# EAGLE design carrier (EAGLE 5.11)

## Sheet 1 of 3
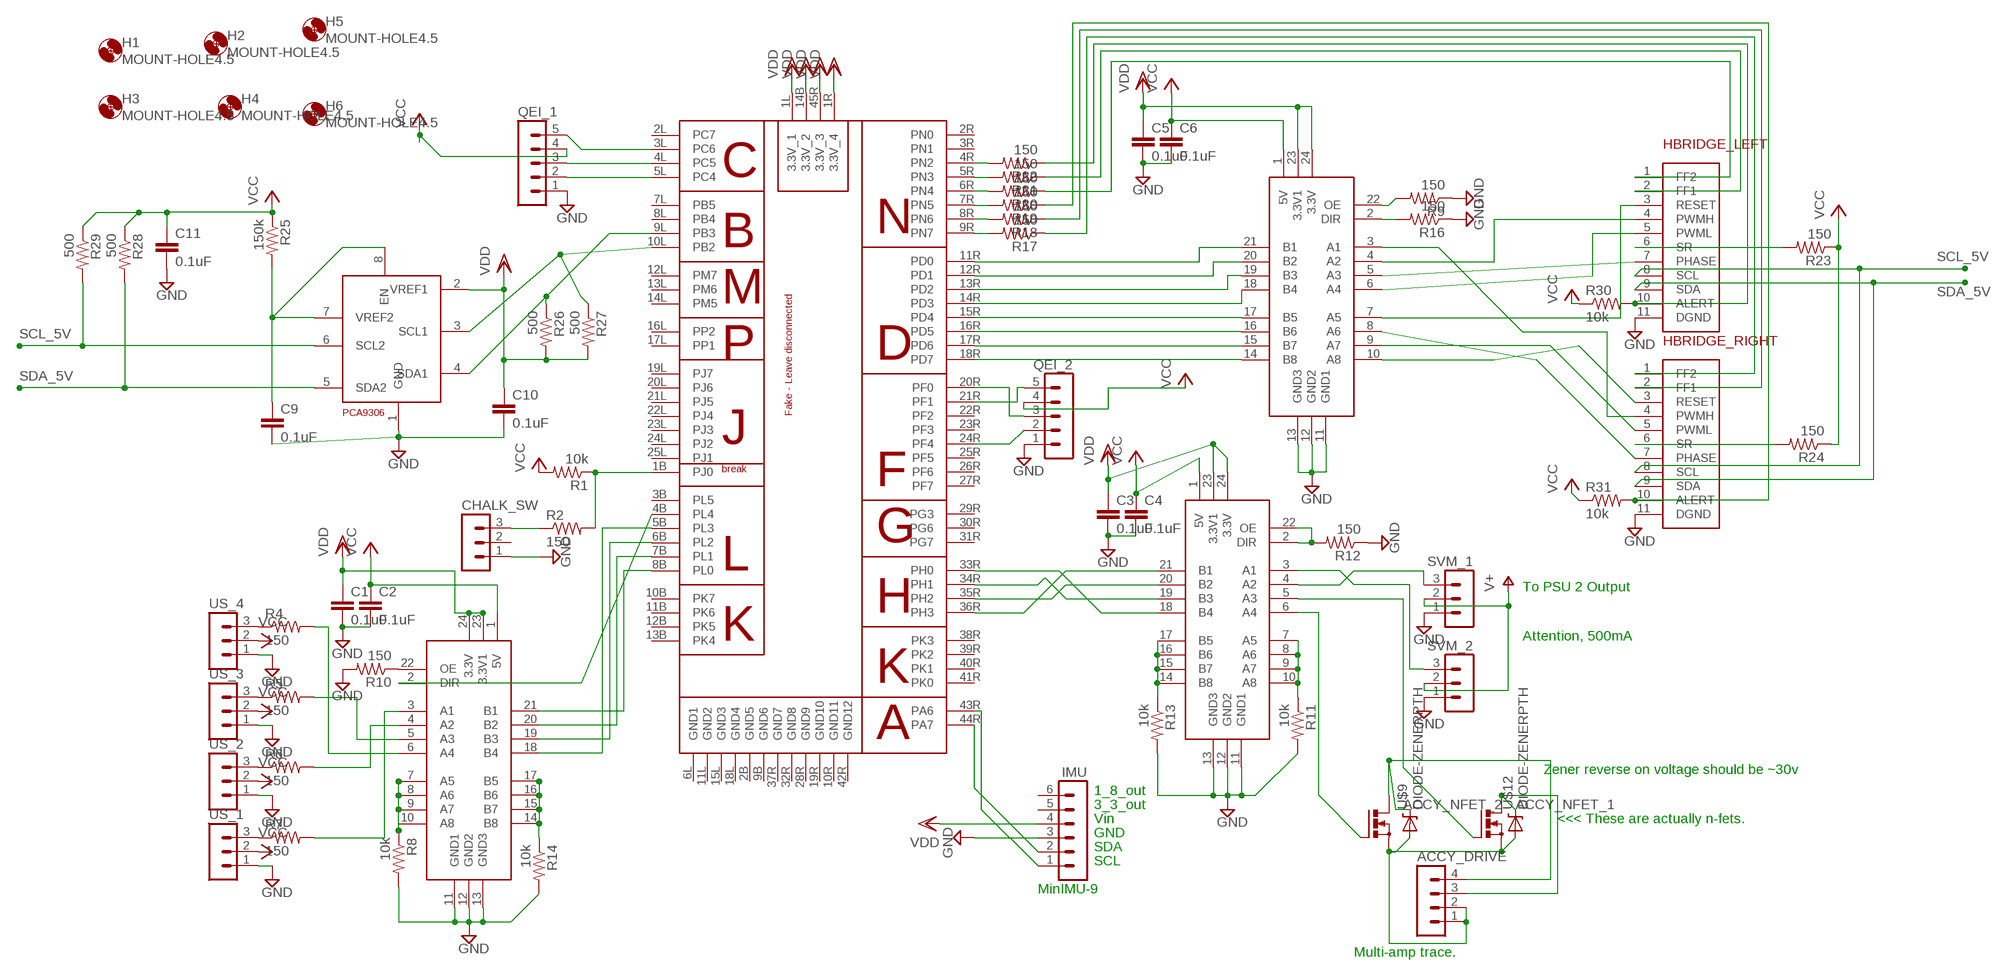
[diagram p0: schematic, sheet 1]

### Parts
ACCY_DRIVE  MA04-1  [MA04-1]
ACCY_NFET_1  PMOSFET_NTO220BH  [TO220BH]
ACCY_NFET_2  PMOSFET_NTO220BH  [TO220BH]
C1  0.1uF  CAP0805  [0805]
C2  0.1uF  CAP0805  [0805]
C3  0.1uF  CAP0805  [0805]
C4  0.1uF  CAP0805  [0805]
C5  0.1uF  CAP0805  [0805]
C6  0.1uF  CAP0805  [0805]
C9  0.1uF  CAP0805  [0805]
C10  0.1uF  CAP0805  [0805]
C11  0.1uF  CAP0805  [0805]
CHALK_SW  MA03-1  [MA03-1]
H1  MOUNT-HOLE4.5  [4,5]
H2  MOUNT-HOLE4.5  [4,5]
H3  MOUNT-HOLE4.5  [4,5]
H4  MOUNT-HOLE4.5  [4,5]
H5  MOUNT-HOLE4.5  [4,5]
H6  MOUNT-HOLE4.5  [4,5]
HBRIDGE_LEFT  HBRIDGE  [HBRIDGE]
HBRIDGE_RIGHT  HBRIDGE  [HBRIDGE]
IMU  MA06-1  [MA06-1]
QEI_1  MA05-1  [MA05-1]
QEI_2  MA05-1  [MA05-1]
R1  10k  R-US_M1206  [M1206]
R2  150  R-US_M1206  [M1206]
R4  150  R-US_M1206  [M1206]
R5  150  R-US_M1206  [M1206]
R6  150  R-US_M1206  [M1206]
R7  150  R-US_M1206  [M1206]
R8  10k  R-US_M1206  [M1206]
R9  150  R-US_M1206  [M1206]
R10  150  R-US_M1206  [M1206]
R11  10k  R-US_M1206  [M1206]
R12  150  R-US_M1206  [M1206]
R13  10k  R-US_M1206  [M1206]
R14  10k  R-US_M1206  [M1206]
R16  150  R-US_M1206  [M1206]
R17  150  RESISTORPTH-1/4W  [AXIAL-0.4]
R18  150  RESISTORPTH-1/4W  [AXIAL-0.4]
R19  150  RESISTORPTH-1/4W  [AXIAL-0.4]
R20  150  RESISTORPTH-1/4W  [AXIAL-0.4]
R21  150  RESISTORPTH-1/4W  [AXIAL-0.4]
R22  150  R-US_0207/15  [0207/15]
R23  150  R-US_M1206  [M1206]
R24  150  R-US_M1206  [M1206]
R25  150k  R-US_M1206  [M1206]
R26  500  R-US_M1206  [M1206]
R27  500  R-US_M1206  [M1206]
R28  500  R-US_M1206  [M1206]
R29  500  R-US_M1206  [M1206]
R30  10k  R-US_M1206  [M1206]
R31  10k  R-US_M1206  [M1206]
SVM_1  MA03-1  [MA03-1]
SVM_2  MA03-1  [MA03-1]
U$1  EK-LM4F232  [EK-LM4F232]
U$6  PCA9306  [SOP-08]
U$7  SN74LVC4245A  [SO-24DW]
U$8  SN74LVC4245A  [SO-24DW]
U$9  DIODE-ZENERPTH  [DIODE-ZENER]
U$10  SN74LVC4245A  [SO-24DW]
U$12  DIODE-ZENERPTH  [DIODE-ZENER]
US_1  MA03-1  [MA03-1]
US_2  MA03-1  [MA03-1]
US_3  MA03-1  [MA03-1]
US_4  MA03-1  [MA03-1]

### Nets
GND: C1.2 C2.2 C3.2 C4.2 C5.2 C6.2 C9.2 C10.2 C11.2 CHALK_SW.1 HBRIDGE_LEFT.11(DGND) HBRIDGE_RIGHT.11(DGND) IMU.3 QEI_1.1 QEI_2.1 R8.2 R9.1 R10.2 R11.2 R12.1 R13.2 R14.2 R16.1 SVM_1.1 SVM_2.1 U$6.1(GND) U$7.11(GND1) U$7.12(GND2) U$7.13(GND3) U$8.11(GND1) U$8.12(GND2) U$8.13(GND3) U$10.11(GND1) U$10.12(GND2) U$10.13(GND3) US_1.1 US_2.1 US_3.1 US_4.1 ; also sheet 2
N$1: R1.1 R2.2 U$1.1B(PJ0)
N$2: CHALK_SW.3 R2.1
N$3: R7.2 U$8.3(A1)
N$4: R6.2 U$8.4(A2)
N$5: R5.2 U$8.5(A3)
N$6: R4.2 U$8.6(A4)
N$7: R4.1 US_4.3
N$8: R5.1 US_3.3
N$9: R6.1 US_2.3
N$10: R7.1 US_1.3
N$11: U$1.36R(PH3) U$7.21(B1)
N$12: R8.1 U$8.7(A5) U$8.8(A6) U$8.9(A7) U$8.10(A8)
N$13: U$1.5B(PL3) U$8.18(B4)
N$15: U$1.6B(PL2) U$8.19(B3)
N$17: QEI_2.3 U$1.20R(PF0)
N$18: U$1.7B(PL1) U$8.20(B2)
N$19: U$1.8B(PL0) U$8.21(B1)
N$20: U$1.35R(PH2) U$7.20(B2)
N$21: U$1.4B(PL4) U$8.2(DIR)
N$22: R10.1 U$8.22(OE)
N$23: U$1.34R(PH1) U$7.19(B3)
N$24: U$1.33R(PH0) U$7.18(B4)
N$26: R12.2 U$7.2(DIR) U$7.22(OE)
N$27: SVM_1.3 U$7.4(A2)
N$28: HBRIDGE_LEFT.7(PHASE) U$10.5(A3)
N$29: SVM_2.3 U$7.3(A1)
N$30: R11.1 U$7.7(A5) U$7.8(A6) U$7.9(A7) U$7.10(A8)
N$31: R16.2 U$10.2(DIR)
N$32: U$1.16R(PD5) U$10.16(B6)
N$33: U$1.15R(PD4) U$10.17(B5)
N$34: R9.2 U$10.22(OE)
N$35: R13.1 U$7.14(B8) U$7.15(B7) U$7.16(B6) U$7.17(B5)
N$36: U$1.14R(PD3) U$10.18(B4)
N$37: U$1.13R(PD2) U$10.19(B3)
N$38: U$1.17R(PD6) U$10.15(B7)
N$39: U$1.18R(PD7) U$10.14(B8)
N$40: U$1.12R(PD1) U$10.20(B2)
N$41: U$1.11R(PD0) U$10.21(B1)
N$42: HBRIDGE_LEFT.4(PWMH) U$10.4(A2)
N$43: HBRIDGE_RIGHT.4(PWMH) U$10.3(A1)
N$44: HBRIDGE_LEFT.3(RESET) U$10.7(A5)
N$45: HBRIDGE_LEFT.5(PWML) U$10.6(A4)
N$46: R14.1 U$8.14(B8) U$8.15(B7) U$8.16(B6) U$8.17(B5)
N$47: HBRIDGE_RIGHT.3(RESET) U$10.10(A8)
N$48: HBRIDGE_RIGHT.5(PWML) U$10.9(A7)
N$49: HBRIDGE_RIGHT.7(PHASE) U$10.8(A6)
N$50: R17.P$2 U$1.9R(PN7)
N$51: R18.P$2 U$1.8R(PN6)
N$52: R19.P$2 U$1.7R(PN5)
N$53: R20.P$2 U$1.6R(PN4)
N$54: R21.P$2 U$1.5R(PN3)
N$55: R22.2 U$1.4R(PN2)
N$56: HBRIDGE_LEFT.6(SR) R23.2
N$57: HBRIDGE_LEFT.1(FF2) R20.P$1
N$58: HBRIDGE_LEFT.2(FF1) R21.P$1
N$59: HBRIDGE_LEFT.10(ALERT) R22.1 R30.2
N$60: HBRIDGE_RIGHT.1(FF2) R17.P$1
N$61: HBRIDGE_RIGHT.2(FF1) R18.P$1
N$62: HBRIDGE_RIGHT.10(ALERT) R19.P$1 R31.2
N$63: HBRIDGE_RIGHT.6(SR) R24.2
N$66: QEI_2.5 U$1.21R(PF1)
N$67: QEI_2.2 U$1.24R(PF4)
N$69: QEI_1.5 U$1.3L(PC6)
N$70: QEI_1.3 U$1.4L(PC5)
N$71: QEI_1.2 U$1.5L(PC4)
N$72: IMU.2 U$1.44R(PA7)
N$73: IMU.1 U$1.43R(PA6)
N$74: C9.1 R25.2 U$6.7(VREF2) U$6.8(EN)
N$75: R27.1 U$1.10L(PB2) U$6.3(SCL1)
N$76: R26.1 U$1.9L(PB3) U$6.4(SDA1)
N$79: ACCY_NFET_2.G U$7.6(A4)
N$80: ACCY_NFET_1.G U$7.5(A3)
N$81: ACCY_DRIVE.1 ACCY_DRIVE.2 ACCY_NFET_1.S ACCY_NFET_2.S U$9.P$2(A) U$12.P$2(A)
N$82: ACCY_DRIVE.3 ACCY_NFET_1.D U$12.P$1(C)
N$83: ACCY_DRIVE.4 ACCY_NFET_2.D U$9.P$1(C)
SCL_5V: HBRIDGE_LEFT.8(SCL) HBRIDGE_RIGHT.8(SCL) R29.2 U$6.6(SCL2)
SDA_5V: HBRIDGE_LEFT.9(SDA) HBRIDGE_RIGHT.9(SDA) R28.2 U$6.5(SDA2)
V+: SVM_1.2 SVM_2.2 ; also sheet 2
VCC: C2.1 C4.1 C6.1 C11.1 QEI_1.4 QEI_2.4 R1.2 R23.1 R24.1 R25.1 R28.1 R29.1 R30.1 R31.1 U$7.1(5V) U$8.1(5V) U$10.1(5V) US_1.2 US_2.2 US_3.2 US_4.2 ; also sheet 2
VDD: C1.1 C3.1 C5.1 C10.1 IMU.4 R26.2 R27.2 U$1.1L(3.3V_1) U$1.1R(3.3V_4) U$1.14B(3.3V_2) U$1.45R(3.3V_3) U$6.2(VREF1) U$7.23(3.3V1) U$7.24(3.3V) U$8.23(3.3V1) U$8.24(3.3V) U$10.23(3.3V1) U$10.24(3.3V)
Unconnected: CHALK_SW.2 IMU.5 IMU.6 U$1.2B(GND5) U$1.2L(PC7) U$1.2R(PN0) U$1.3B(PL5) U$1.3R(PN1) U$1.6L(GND1) U$1.7L(PB5) U$1.8L(PB4) U$1.9B(GND6) U$1.10B(PK7) U$1.10R(GND11) U$1.11B(PK6) U$1.11L(GND2) U$1.12B(PK5) U$1.12L(PM7) U$1.13B(PK4) U$1.13L(PM6) U$1.14L(PM5) U$1.15L(GND3) U$1.16L(PP2) U$1.17L(PP1) U$1.18L(GND4) U$1.19L(PJ7) U$1.19R(GND10) U$1.20L(PJ6) U$1.21L(PJ5) U$1.22L(PJ4) U$1.22R(PF2) U$1.23L(PJ3) U$1.23R(PF3) U$1.24L(PJ2) U$1.25L(PJ1) U$1.25R(PF5) U$1.26R(PF6) U$1.27R(PF7) U$1.28R(GND9) U$1.29R(PG3) U$1.30R(PG6) U$1.31R(PG7) U$1.32R(GND8) U$1.37R(GND7) U$1.38R(PK3) U$1.39R(PK2) U$1.40R(PK1) U$1.41R(PK0) U$1.42R(GND12) U$1.F3(F5) U$1.F4 U$1.F5(F3) U$1.F6(F2)

### Notes on the sheet
- To PSU 2 Output
- Attention, 500mA
- Zener reverse on voltage should be ~30v
- 1_8_out
- 3_3_out
- Vin | <<< These are actually n-fets.
- GND
- SDA
- SCL
- MinIMU-9
- Multi-amp trace.

## Sheet 2 of 3
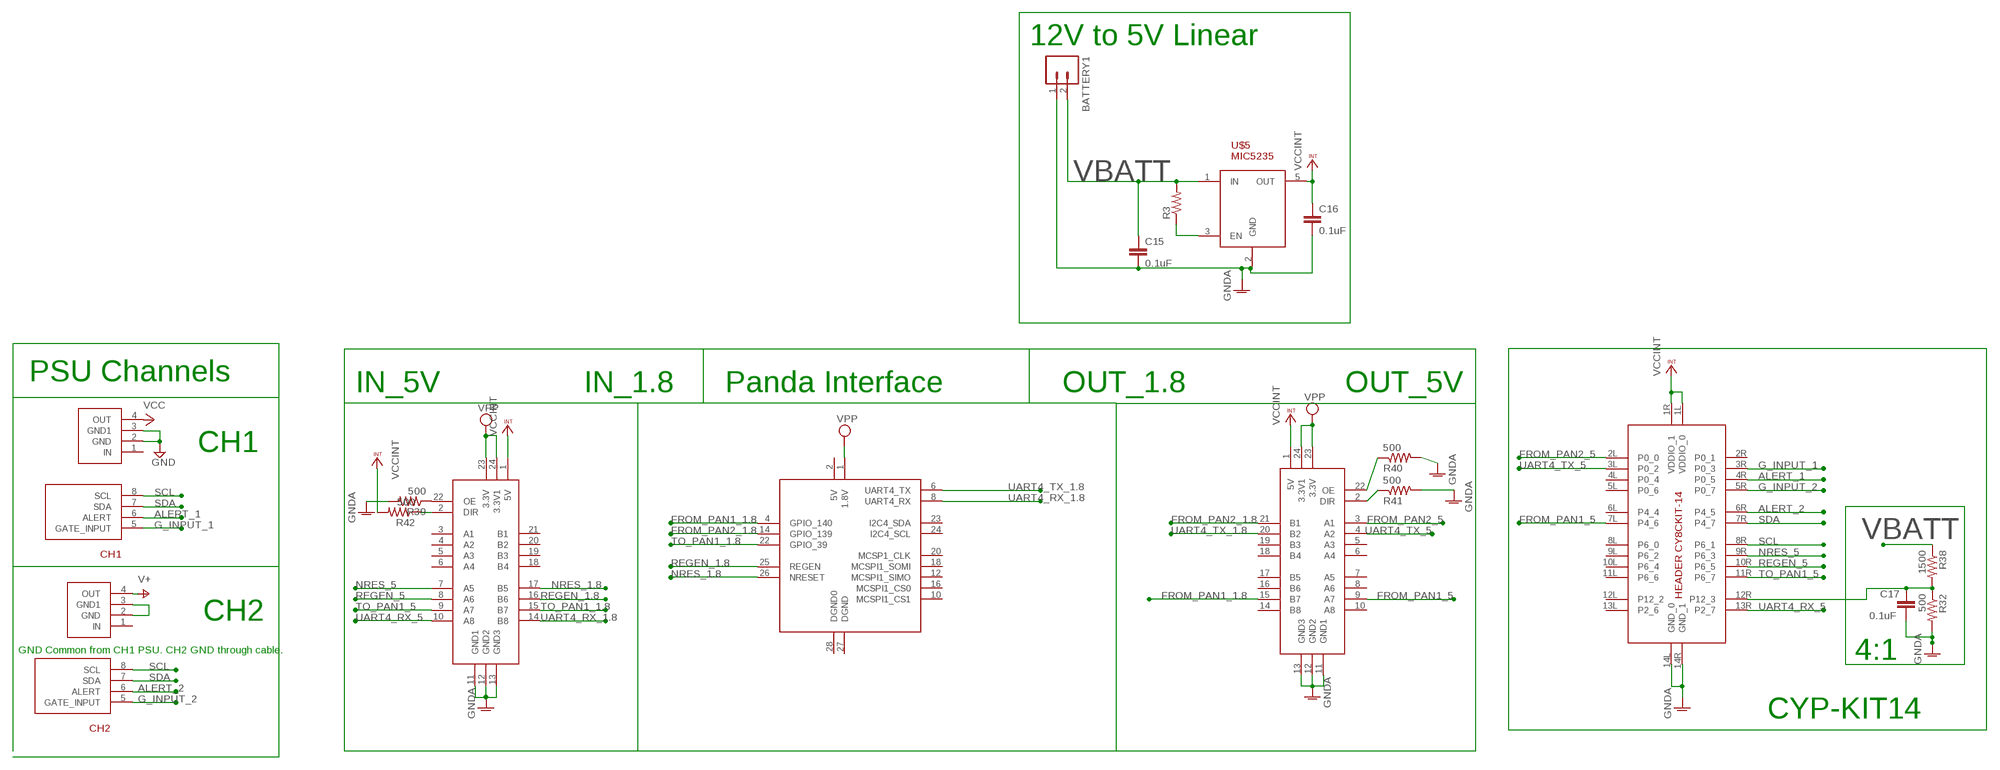
[diagram p1: schematic, sheet 2]

### Parts
BATTERY1  M02  [02P]
C15  0.1uF  CAP0805  [0805]
C16  0.1uF  CAP0805  [0805]
C17  0.1uF  CAP0805  [0805]
CH1  PSUPPLY  [PSUPPLY]
CH2  PSUPPLY  [PSUPPLY]
IN_5V  SN74LVCH8T245  [SO-24DW]
OUT_5V  SN74LVCH8T245  [SO-24DW]
R3  RESISTOR1206  [1206]
R32  500  R-US_M1206  [M1206]
R38  1500  R-US_M1206  [M1206]
R39  500  R-US_M1206  [M1206]
R40  500  R-US_M1206  [M1206]
R41  500  R-US_M1206  [M1206]
R42  500  R-US_M1206  [M1206]
U$2  CY8CKIT  [2X14-0.5"]
U$3  PANDABOARD  [PANDABOARD]
U$5  MIC5235  [SOT23-5]

### Nets
ALERT_1: CH1.6(ALERT) U$2.4R(P0_5)
ALERT_2: CH2.6(ALERT) U$2.6R(P4_5)
FROM_PAN1_1.8: OUT_5V.15(B7) U$3.4(GPIO_140)
FROM_PAN1_5: OUT_5V.9(A7) U$2.7L(P4_6)
FROM_PAN2_1.8: OUT_5V.21(B1) U$3.14(GPIO_139)
FROM_PAN2_5: OUT_5V.3(A1) U$2.2L(P0_0)
G_INPUT_1: CH1.5(GATE_INPUT) U$2.3R(P0_3)
G_INPUT_2: CH2.5(GATE_INPUT) U$2.5R(P0_7)
GND: CH1.2(GND) CH1.3(GND1) ; also sheet 1
GNDA: BATTERY1.1 C15.2 C16.2 C17.2 IN_5V.11(GND1) IN_5V.12(GND2) IN_5V.13(GND3) OUT_5V.11(GND1) OUT_5V.12(GND2) OUT_5V.13(GND3) R32.2 R39.2 R40.2 R41.2 U$2.14L(GND_0) U$2.14R(GND_1) U$5.2(GND)
N$14: C17.1 R32.1 R38.2 U$2.12R(P12_3)
N$16: R3.1 U$5.3(EN)
N$25: CH2.2(GND) CH2.3(GND1)
N$89: IN_5V.22(OE) R39.1
N$90: OUT_5V.22(OE) R40.1
N$91: OUT_5V.2(DIR) R41.1
N$92: IN_5V.2(DIR) R42.1
NRES_1.8: IN_5V.17(B5) U$3.26(NRESET)
NRES_5: IN_5V.7(A5) U$2.9R(P6_3)
REGEN_1.8: IN_5V.16(B6) U$3.25(REGEN)
REGEN_5: IN_5V.8(A6) U$2.10R(P6_5)
SCL: CH1.8(SCL) CH2.8(SCL) U$2.8R(P6_1)
SDA: CH1.7(SDA) CH2.7(SDA) U$2.7R(P4_7)
TO_PAN1_1.8: IN_5V.15(B7) U$3.22(GPIO_39)
TO_PAN1_5: IN_5V.9(A7) U$2.11R(P6_7)
UART4_RX_1.8: IN_5V.14(B8) U$3.8(UART4_RX)
UART4_RX_5: IN_5V.10(A8) U$2.13R(P2_7)
UART4_TX_1.8: OUT_5V.20(B2) U$3.6(UART4_TX)
UART4_TX_5: OUT_5V.4(A2) U$2.3L(P0_2)
V+: CH2.4(OUT) ; also sheet 1
VBATT: BATTERY1.2 C15.1 R3.2 R38.1 U$5.1(IN)
VCC: CH1.4(OUT) ; also sheet 1
VCCINT: C16.1 IN_5V.1(5V) OUT_5V.1(5V) R42.2 U$2.1L(VDDIO_0) U$2.1R(VDDIO_1) U$5.5(OUT)
VPP: IN_5V.23(3.3V) IN_5V.24(3.3V1) OUT_5V.23(3.3V) OUT_5V.24(3.3V1) U$3.1(1.8V)
Unconnected: CH1.1(IN) CH2.1(IN) IN_5V.3(A1) IN_5V.4(A2) IN_5V.5(A3) IN_5V.6(A4) IN_5V.18(B4) IN_5V.19(B3) IN_5V.20(B2) IN_5V.21(B1) OUT_5V.5(A3) OUT_5V.6(A4) OUT_5V.7(A5) OUT_5V.8(A6) OUT_5V.10(A8) OUT_5V.14(B8) OUT_5V.16(B6) OUT_5V.17(B5) OUT_5V.18(B4) OUT_5V.19(B3) U$2.2R(P0_1) U$2.4L(P0_4) U$2.5L(P0_6) U$2.6L(P4_4) U$2.8L(P6_0) U$2.9L(P6_2) U$2.10L(P6_4) U$2.11L(P6_6) U$2.12L(P12_2) U$2.13L(P2_6) U$3.2(5V) U$3.10(MCSPI1_CS1) U$3.12(MCSPI1_SIMO) U$3.16(MCSPI1_CS0) U$3.18(MCSPI1_SOMI) U$3.20(MCSP1_CLK) U$3.23(I2C4_SDA) U$3.24(I2C4_SCL) U$3.27(DGND) U$3.28(DGND0)

### Notes on the sheet
- 12V to 5V Linear
- PSU Channels
- IN_5V | IN_1.8 | Panda Interface | OUT_1.8 | OUT_5V
- CH1
- CH2
- GND Common from CH1 PSU. CH2 GND through cable.
- 4:1
- CYP-KIT14

## Sheet 3 of 3

## Library data of the parts
ACCY_DRIVE = con-lstb:MA04-1: PIN HEADER; OC_FARNELL: unknown; OC_NEWARK: unknown
ACCY_NFET_1 ACCY_NFET_2 = transistor-power:PMOSFET_N: Power MOSFET N-Channel
BATTERY1 = con-amp-quick:M02: AMP QUICK CONNECTOR; OC_FARNELL: unknown; OC_NEWARK: unknown
C1-C6 C9-C11 C15-C17 = SparkFun:CAP: Capacitor Standard 0603 ceramic capacitor, and 0.1" leaded capacitor.
CH1 CH2 = chlk_bot:PSUPPLY
CHALK_SW SVM_1 SVM_2 US_1-US_4 = con-lstb:MA03-1: PIN HEADER; OC_FARNELL: unknown; OC_NEWARK: unknown
H1-H6 = holes:MOUNT-HOLE: MOUNTING HOLE with drill center marker
HBRIDGE_LEFT HBRIDGE_RIGHT = chlk_bot:HBRIDGE
IMU = con-lstb:MA06-1: PIN HEADER; OC_FARNELL: unknown; OC_NEWARK: unknown
IN_5V OUT_5V = chlk_bot:SN74LVCH8T245
QEI_1 QEI_2 = con-lstb:MA05-1: PIN HEADER; OC_FARNELL: unknown; OC_NEWARK: unknown
R1 R2 R4-R14 R16 R22-R32 R38-R42 = resistor:R-US_: RESISTOR, American symbol
R3 R17-R21 = SparkFun:RESISTOR: Resistor Basic schematic elements and footprints for 0603, 1206, and PTH resistors.
U$1 = chlk_bot:EK-LM4F232
U$2 = chlk_bot:CY8CKIT
U$3 = chlk_bot:PANDABOARD
U$5 = chlk_bot:MIC5235
U$6 = chlk_bot:PCA9306
U$7 U$8 U$10 = chlk_bot:SN74LVC4245A
U$9 U$12 = SparkFun:DIODE-ZENER: Zener Diode Production Part - 8199 3.4V Zener Voltage

## Board
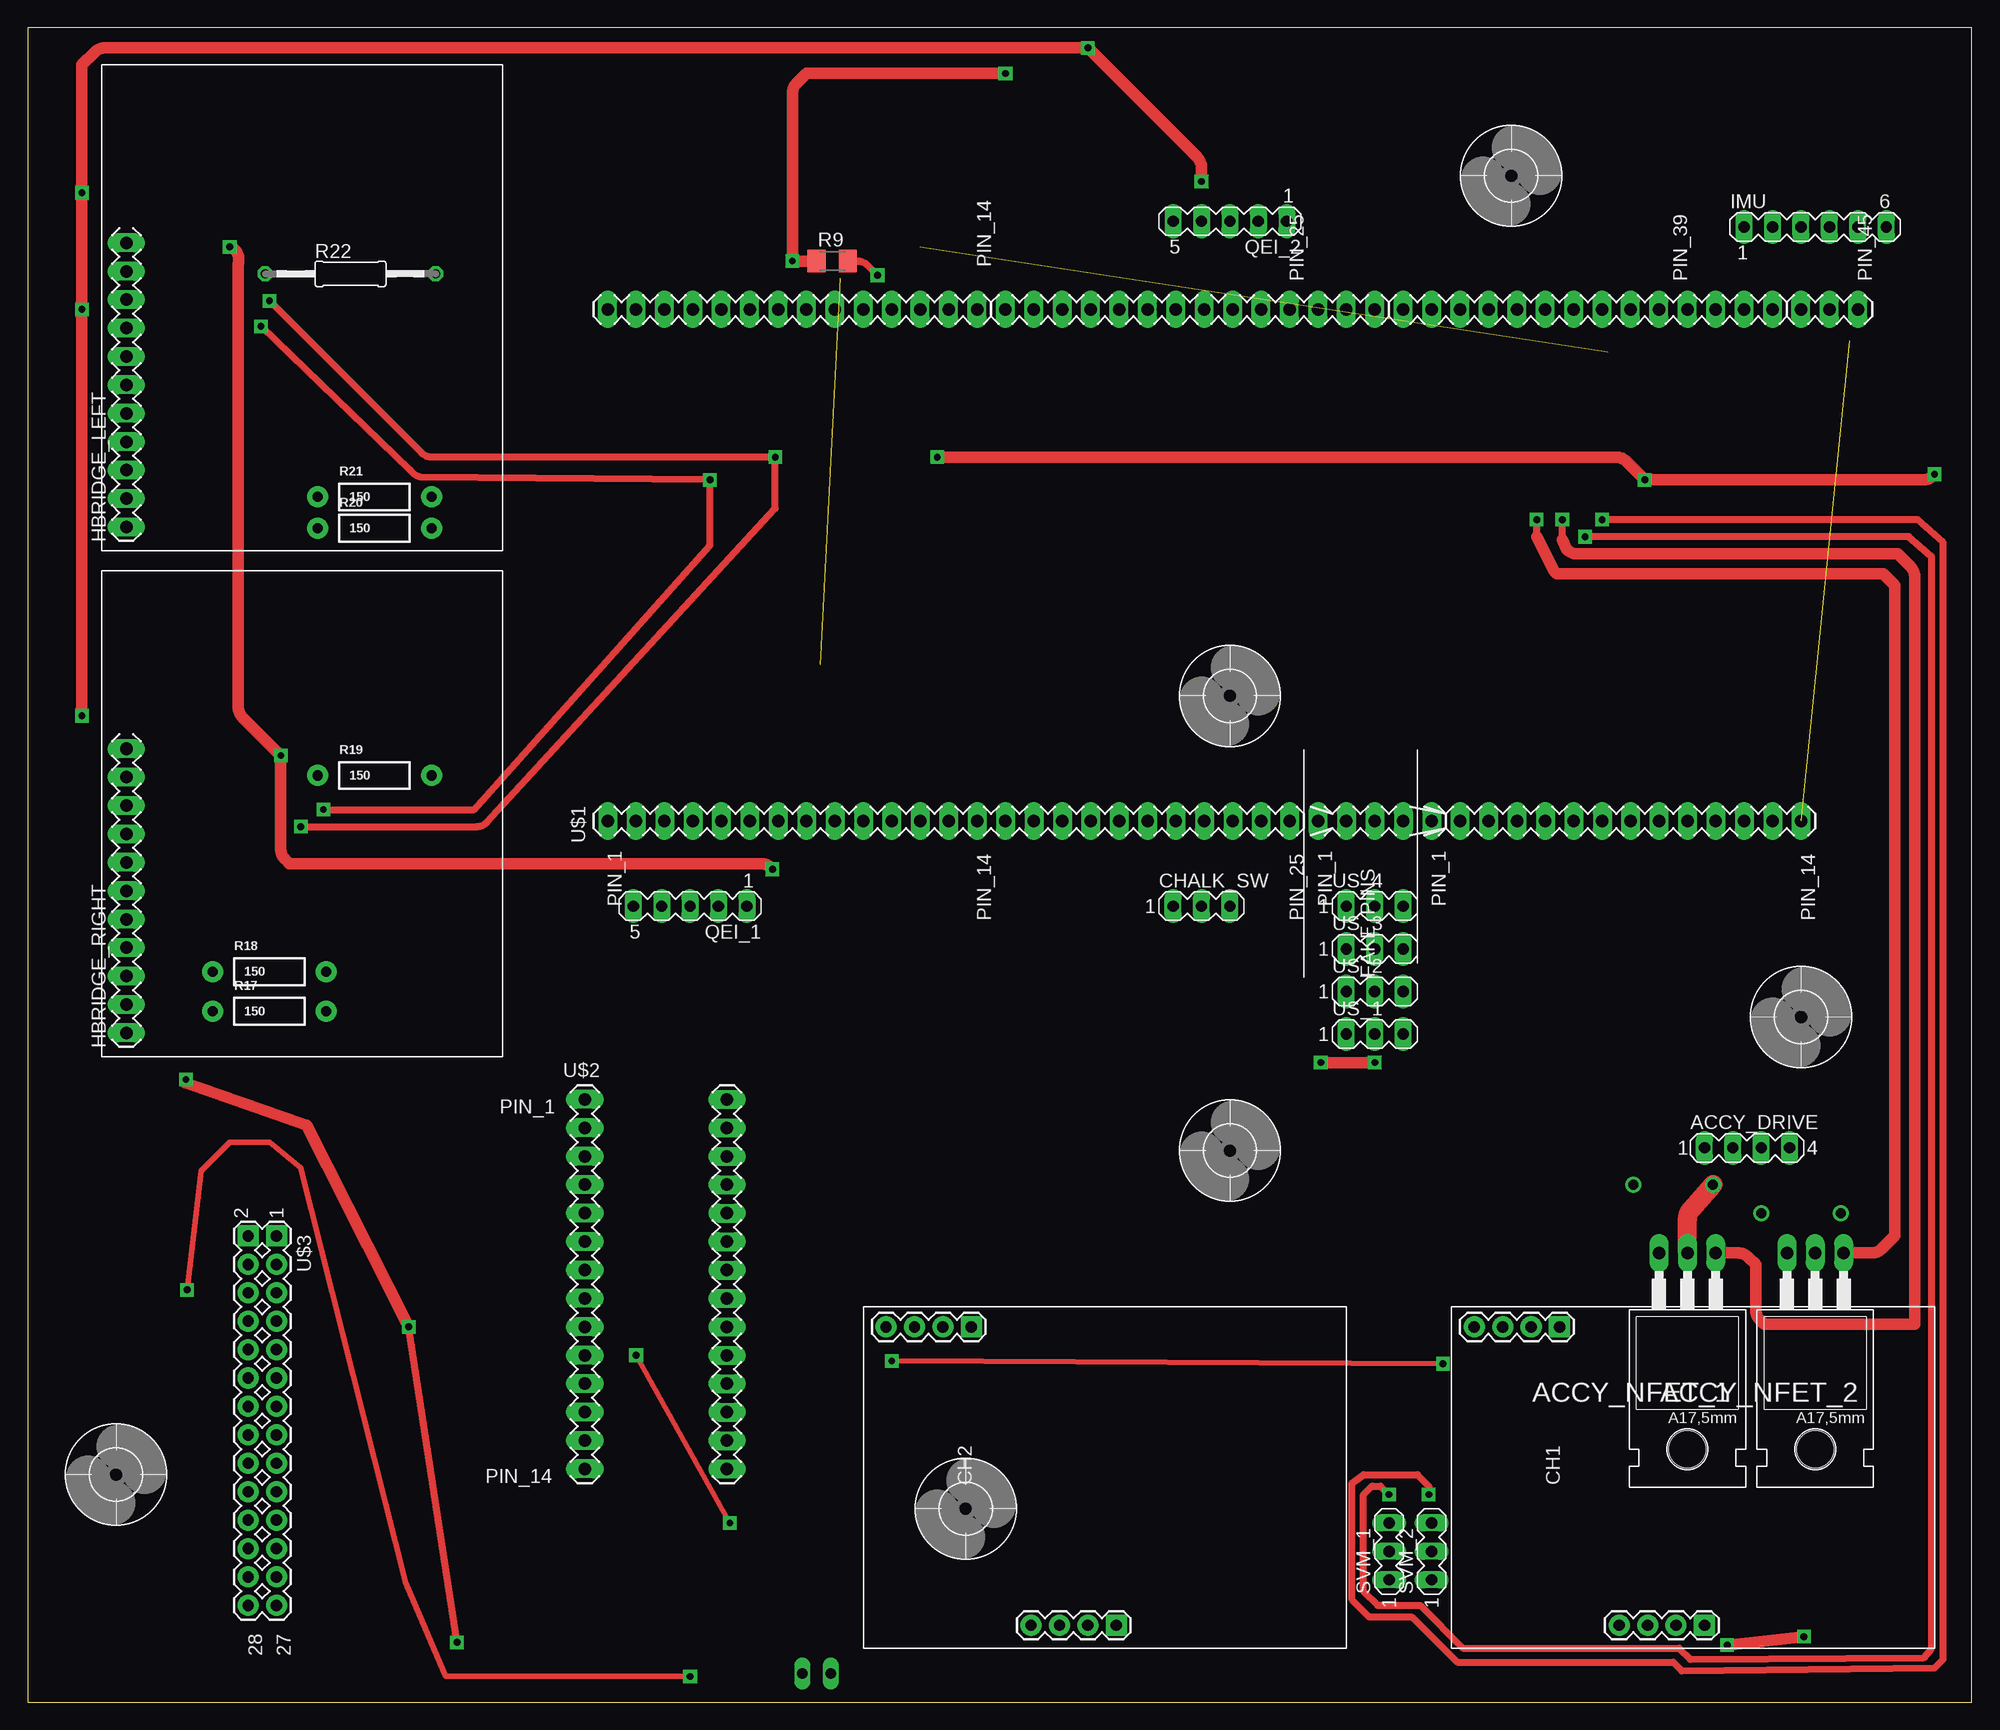
[diagram p2: board, top side]
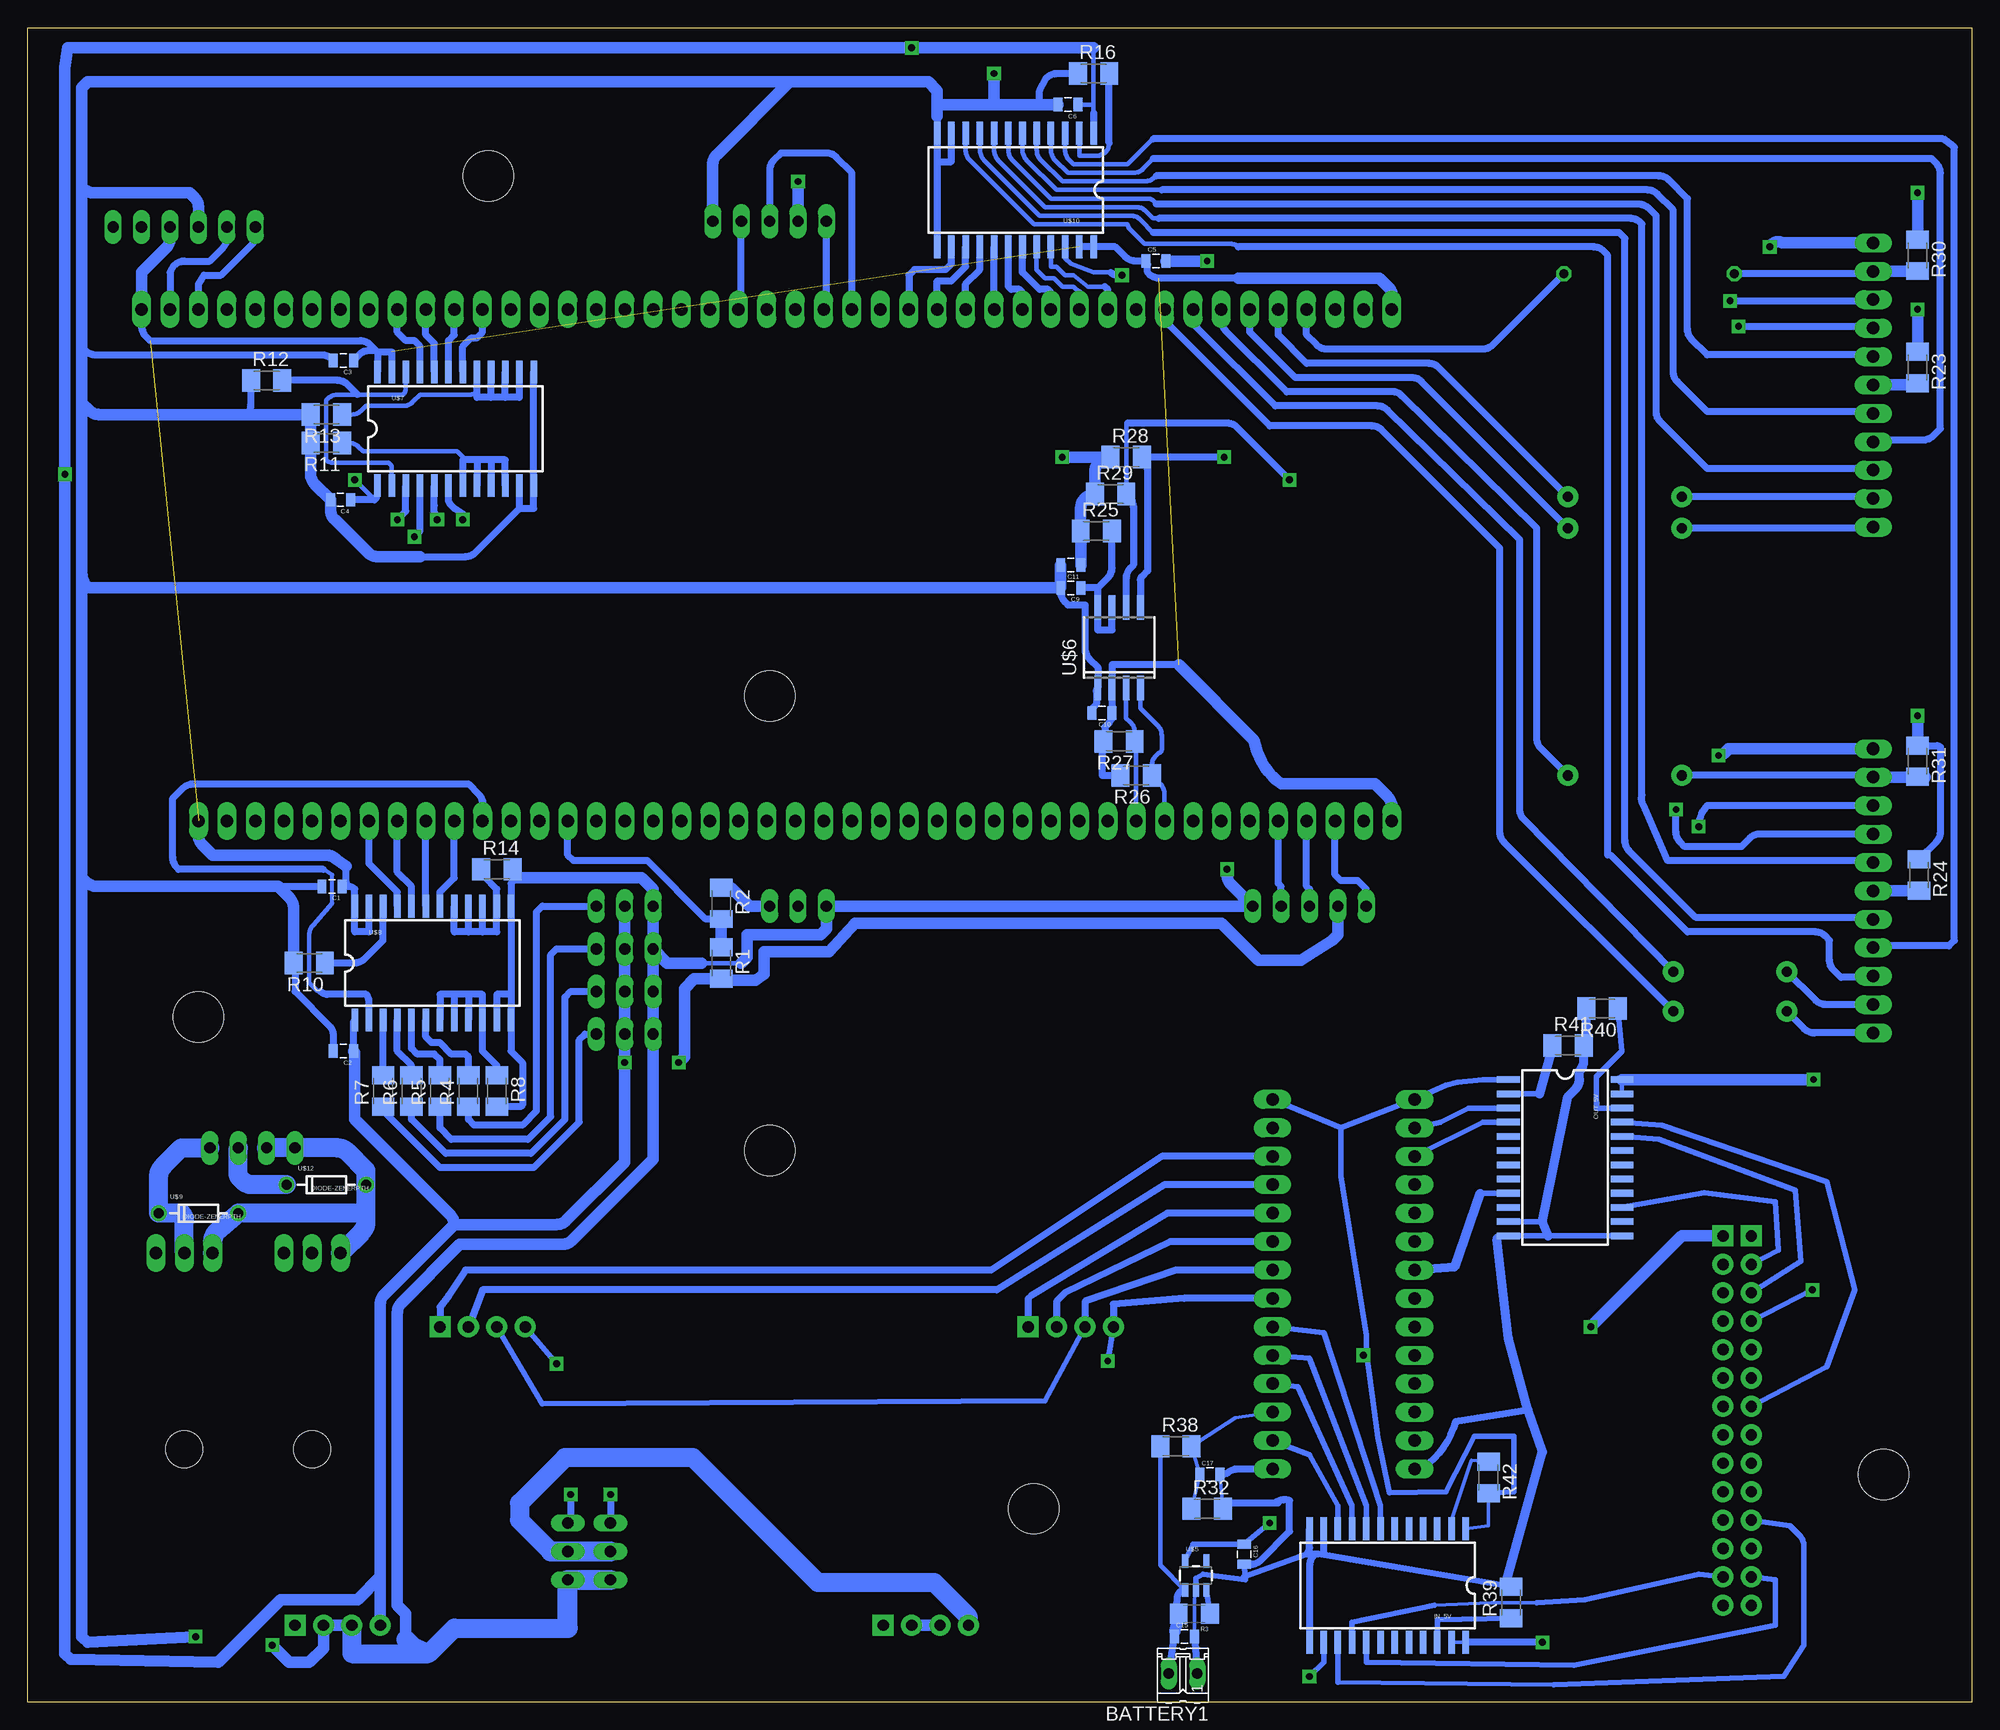
[diagram p3: board, bottom side, seen from below]

Size 173.74 x 149.61 mm. Coordinates in mm from the lower left corner, seen from the top.
Outline: 0,0 173.74,0 173.74,149.61 0,149.61 0,0
Copper layers (1*16): Top 0.035mm / dielectric 1.5mm / Bottom 0.035mm
Design rules "MWSEagleDesignRules *": minimum track width 10mil, minimum drill 24mil, track to track 12mil, track to pad 12mil, pad to pad 12mil, via to via 12mil, smd to smd 12mil, copper to edge 40mil, drill to drill 8mil, minimum pad ring 10mil, minimum via ring 8mil, stop-mask expansion 4mil, vias tented up to drill 0mil, thermal gap 10mil

### Footprints (pad centres in the part's own frame; a part is rotated, then mirrored left to right if it is on the bottom)
MA04-1 = drill 1.016 long: 1 -3.81,0; 2 -1.27,0; 3 1.27,0; 4 3.81,0
TO220BH = drill 1.118 long: D 0,-6.35; G -2.54,-6.35; S 2.54,-6.35 | hole 3.302: 0,11.176
02P = drill 0.914 long: 1 -1.27,0; 2 1.27,0
0805 = smd 0.8 x 1.2: 1 -0.9,0; 2 0.9,0
PSUPPLY = drill 1.016 pad 1.88 square: 1 2.032,20.574; 5 28.702,33.528 | drill 1.016 pad 1.88 round: 2 2.032,23.114; 3 2.032,25.654; 4 2.032,28.194; 6 28.702,36.068; 7 28.702,38.608; 8 28.702,41.148
MA03-1 = drill 1.016 long: 1 -2.54,0; 2 0,0; 3 2.54,0
4,5 = hole 4.5: 0,0
HBRIDGE = drill 1.118 long: 1 1.88,33.63; 2 4.42,33.63; 3 6.96,33.63; 4 9.5,33.63; 5 12.04,33.63; 6 14.58,33.63; 7 17.12,33.63; 8 19.66,33.63; 9 22.2,33.63; 10 24.74,33.63; 11 27.28,33.63
MA06-1 = drill 1.016 long: 1 -6.35,0; 2 -3.81,0; 3 -1.27,0; 4 1.27,0; 5 3.81,0; 6 6.35,0
SO-24DW = smd 0.584 x 2.032: 1 -6.35,-5.08; 2 -5.08,-5.08; 3 -3.81,-5.08; 4 -2.54,-5.08; 5 -1.27,-5.08; 6 0,-5.08; 7 1.27,-5.08; 8 2.54,-5.08; 9 3.81,-5.08; 10 5.08,-5.08; 11 6.35,-5.08; 12 7.62,-5.08; 13 7.62,5.08; 14 6.35,5.08; 15 5.08,5.08; 16 3.81,5.08; 17 2.54,5.08; 18 1.27,5.08; 19 0,5.08; 20 -1.27,5.08; 21 -2.54,5.08; 22 -3.81,5.08; 23 -5.08,5.08; 24 -6.35,5.08
MA05-1 = drill 1.016 long: 1 -5.08,0; 2 -2.54,0; 3 0,0; 4 2.54,0; 5 5.08,0
M1206 = smd 1.6 x 2: 1 -1.4,0; 2 1.4,0
1206 = smd 1.6 x 1.8: 1 -1.4,0; 2 1.4,0
AXIAL-0.4 = drill 0.9 pad 1.88 round: P$1 -5.08,0; P$2 5.08,0
0207/15 = drill 0.813 octagon: 1 -7.62,0; 2 7.62,0
EK-LM4F232 = drill 1.118 long: 1B -45.72,-73.66; 1L -45.72,0; 1R 0,0; 2B -45.72,-76.2; 2L -45.72,-2.54; 2R 0,-2.54; 3B -45.72,-78.74; 3L -45.72,-5.08; 3R 0,-5.08; 4B -45.72,-81.28; 4L -45.72,-7.62; 4R 0,-7.62; 5B -45.72,-83.82; 5L -45.72,-10.16; 5R 0,-10.16; 6B -45.72,-86.36; 6L -45.72,-12.7; 6R 0,-12.7; 7B -45.72,-88.9; 7L -45.72,-15.24; 7R 0,-15.24; 8B -45.72,-91.44; 8L -45.72,-17.78; 8R 0,-17.78; 9B -45.72,-93.98; 9L -45.72,-20.32; 9R 0,-20.32; 10B -45.72,-96.52; 10L -45.72,-22.86; 10R 0,-22.86; 11B -45.72,-99.06; 11L -45.72,-25.4; 11R 0,-25.4; 12B -45.72,-101.6; 12L -45.72,-27.94; 12R 0,-27.94; 13B -45.72,-104.14; 13L -45.72,-30.48; 13R 0,-30.48; 14B -45.72,-106.68; 14L -45.72,-33.02; 14R 0,-33.02; 15L -45.72,-35.56; 15R 0,-35.56; 16L -45.72,-38.1; 16R 0,-38.1; 17L -45.72,-40.64; 17R 0,-40.64; 18L -45.72,-43.18; 18R 0,-43.18; 19L -45.72,-45.72; 19R 0,-45.72; 20L -45.72,-48.26; 20R 0,-48.26; 21L -45.72,-50.8; 21R 0,-50.8; 22L -45.72,-53.34; 22R 0,-53.34; 23L -45.72,-55.88; 23R 0,-55.88; 24L -45.72,-58.42; 24R 0,-58.42; 25L -45.72,-60.96; 25R 0,-60.96; 26R 0,-63.5; 27R 0,-66.04; 28R 0,-68.58; 29R 0,-71.12; 30R 0,-73.66; 31R 0,-76.2; 32R 0,-78.74; 33R 0,-81.28; 34R 0,-83.82; 35R 0,-86.36; 36R 0,-88.9; 37R 0,-91.44; 38R 0,-93.98; 39R 0,-96.52; 40R 0,-99.06; 41R 0,-101.6; 42R 0,-104.14; 43R 0,-106.68; 44R 0,-109.22; 45R 0,-111.76; F3 -45.72,-63.5; F4 -45.72,-66.04; F5 -45.72,-68.58; F6 -45.72,-71.12
2X14-0.5" = drill 1.118 long: 1L -6.35,13.97; 1R 6.35,13.97; 2L -6.35,11.43; 2R 6.35,11.43; 3L -6.35,8.89; 3R 6.35,8.89; 4L -6.35,6.35; 4R 6.35,6.35; 5L -6.35,3.81; 5R 6.35,3.81; 6L -6.35,1.27; 6R 6.35,1.27; 7L -6.35,-1.27; 7R 6.35,-1.27; 8L -6.35,-3.81; 8R 6.35,-3.81; 9L -6.35,-6.35; 9R 6.35,-6.35; 10L -6.35,-8.89; 10R 6.35,-8.89; 11L -6.35,-11.43; 11R 6.35,-11.43; 12L -6.35,-13.97; 12R 6.35,-13.97; 13L -6.35,-16.51; 13R 6.35,-16.51; 14L -6.35,-19.05; 14R 6.35,-19.05
PANDABOARD = drill 1.016 pad 1.88 square: 1 0,0; 2 0,-2.54 | drill 1.016 pad 1.88 round: 3 2.54,0; 4 2.54,-2.54; 5 5.08,0; 6 5.08,-2.54; 7 7.62,0; 8 7.62,-2.54; 9 10.16,0; 10 10.16,-2.54; 11 12.7,0; 12 12.7,-2.54; 13 15.24,0; 14 15.24,-2.54; 15 17.78,0; 16 17.78,-2.54; 17 20.32,0; 18 20.32,-2.54; 19 22.86,0; 20 22.86,-2.54; 21 25.4,0; 22 25.4,-2.54; 23 27.94,0; 24 27.94,-2.54; 25 30.48,0; 26 30.48,-2.54; 27 33.02,0; 28 33.02,-2.54
SOT23-5 = smd 0.55 x 1.2: 1 -0.95,-1.3; 2 0,-1.3; 3 0.95,-1.3; 4 0.95,1.3; 5 -0.95,1.3
SOP-08 = smd 0.6 x 2.2: 1 -1.905,-3.6; 2 -0.635,-3.6; 3 0.635,-3.6; 4 1.905,-3.6; 5 1.905,3.575; 6 0.635,3.575; 7 -0.635,3.575; 8 -1.905,3.575
DIODE-ZENER = drill 0.9 round: P$1 -3.556,0; P$2 3.556,0

### Placement (x,y rotation side)
ACCY_DRIVE  153.67,49.53 0 top
ACCY_NFET_1  148.34,33.78 180 top
ACCY_NFET_2  159.77,33.78 180 top
BATTERY1  70.48,2.54 180 bottom
C1  146.56,72.9 180 bottom
C2  145.54,58.17 180 bottom
C3  145.54,119.89 180 bottom
C4  145.8,107.44 180 bottom
C5  72.9,128.78 0 bottom
C6  80.77,142.75 180 bottom
C9  80.52,99.57 180 bottom
C10  77.72,88.39 180 bottom
C11  80.52,101.6 180 bottom
C15  70.36,5.84 0 bottom
C16  65.02,13.21 270 bottom
C17  68.07,20.32 0 bottom
CH1  170.43,4.83 90 top
CH2  117.86,4.83 90 top
CHALK_SW  104.9,71.12 0 top
H1  107.44,89.92 0 top
H2  132.59,136.4 0 top
H3  7.87,20.32 0 top
H4  83.82,17.27 0 top
H5  158.5,61.21 0 top
H6  107.44,49.28 0 top
HBRIDGE_LEFT  42.42,103.12 90 top
HBRIDGE_RIGHT  42.42,57.91 90 top
IMU  159.77,131.83 0 top
IN_5V  51.56,10.41 180 bottom
OUT_5V  36.32,49.28 270 bottom
QEI_1  59.18,71.12 180 top
QEI_2  107.44,132.33 180 top
R1  111.76,66.04 270 bottom
R2  111.76,71.37 270 bottom
R3  69.47,7.87 180 bottom
R4  134.37,54.61 90 bottom
R5  136.91,54.61 90 bottom
R6  139.45,54.61 90 bottom
R7  141.99,54.61 90 bottom
R8  131.83,54.61 270 bottom
R9  71.88,128.78 0 top
R10  148.59,66.04 180 bottom
R11  147.07,112.52 180 bottom
R12  152.4,118.11 0 bottom
R13  147.07,115.06 180 bottom
R14  131.83,74.42 0 bottom
R16  78.49,145.54 0 bottom
R17  21.59,61.72 0 top
R18  21.59,65.28 0 top
R19  30.99,82.8 0 top
R20  30.99,104.9 0 top
R21  30.99,107.7 0 top
R22  28.83,127.63 0 top
R23  4.83,119.25 270 bottom
R24  4.7,73.91 270 bottom
R25  78.23,104.65 0 bottom
R26  74.68,82.8 180 bottom
R27  76.2,85.85 180 bottom
R28  75.56,111.25 0 bottom
R29  76.96,107.95 0 bottom
R30  4.83,129.29 270 bottom
R31  4.83,84.07 270 bottom
R32  68.33,17.27 0 bottom
R38  71.12,22.86 0 bottom
R39  41.15,8.89 90 bottom
R40  33.02,61.98 180 bottom
R41  36.07,58.67 0 bottom
R42  43.18,20.07 270 bottom
SVM_1  121.67,13.46 90 top
SVM_2  125.48,13.46 90 top
U$1  51.82,124.46 90 top
U$2  56.13,39.88 0 top
U$3  22.23,41.66 270 top
U$5  69.34,11.3 0 bottom
U$6  76.2,94.23 0 bottom
U$7  136.14,113.79 0 bottom
U$8  138.18,66.04 0 bottom
U$9  158.5,43.69 0 bottom
U$10  84.84,135.13 180 bottom
U$12  147.07,46.23 0 bottom
US_1  120.4,59.69 0 top
US_2  120.4,63.5 0 top
US_3  120.4,67.31 0 top
US_4  120.4,71.12 0 top

### Tracks (layer width: path | path; a pad name or v marks a point on that pad's centre or on a via)
ALERT_1
  Bottom 0.61: CH1.6 133.1,36.83 87.12,36.83 72.14,46.23 U$2.4R
ALERT_2
  Bottom 0.61: CH2.6 81.79,35.81 81.03,36.58 71.63,41.15 U$2.6R
FROM_PAN1_1.8
  Bottom 0.508: OUT_5V.15 23.87,45.52 17.53,44.7 17.27,40.39 U$3.4
FROM_PAN1_5
  Bottom 0.508: OUT_5V.9 43.94,45.47
  Bottom 0.813: 43.94,45.47 46.23,38.86 U$2.7L
FROM_PAN2_1.8
  Bottom 0.508: OUT_5V.21 27.69,51.56 12.95,46.48 10.41,36.83 12.95,29.97 U$3.14
FROM_PAN2_5
  Bottom 0.508: OUT_5V.3 44.96,53.09 47.5,51.82 49.53,51.31 U$2.2L
G_INPUT_1
  Bottom 0.61: CH1.5 136.91,35.31 136.14,36.32 134.62,38.61 87.63,38.61 72.39,48.77 U$2.3R
G_INPUT_2
  Bottom 0.406: 84.07,36.32 84.33,36.07
  Bottom 0.61: 84.07,36.32 71.88,43.69 U$2.5R | 84.33,36.07 CH2.5
GND  (via drill 0.61)
  Top 1.016: v158.75,5.84 v151.89,5.08 | v87.38,145.54 69.6,145.54 68.7,144.64 arc45 68.33,143.75 v68.33,128.78 R9.1 | v66.55,74.42 66.41,74.56 arc45 65.51,74.93 23.37,74.93 22.98,75.32 arc-45 22.61,76.22 v22.61,84.58 19.17,88.02 arc-45 18.8,88.92 18.8,128.52 arc90 v18.03,130.05
  Bottom 0.406: 113.54,66.04 109.98,66.04
  Bottom 0.61: R8.2 129.67,53.21 129.54,53.34 129.54,57.15 130.56,58.17 U$8.12 130.56,63.25 | U$8.11 131.83,63.25 130.56,63.25 | 130.56,63.25 U$8.13 130.56,73.15 130.05,73.66 arc45 130.69,73.93 R14.2 | 92.46,137.67 U$10.12 92.46,141.73 | 92.46,137.67 91.19,137.67 U$10.11 | 92.46,137.67 U$10.13 | R16.1 81.77,145.54 arc-45 82.67,145.17 83.31,144.02 83.31,142.75 | 168.77,135.25 168.91,135.38 | R12.1 153.8,115.97 arc45 154.17,115.07 154.18,115.06 | C3.2 146.58,120.02 arc-45 147.48,120.4 167.64,120.4 arc62 168.91,121.16 | 138.68,102.36 134.64,102.36 arc-45 133.74,102.73 129.79,106.68 | 129.79,106.68 U$7.11 | 129.79,106.68 128.52,106.68 U$7.12 U$7.13 | 151.38,72.9 C1.2 | C2.2 146.44,59.56 arc-45 146.81,60.45 149.86,63.5 149.86,65.73 arc-45 R10.2 | C9.2 81.42,99.22 arc-45 81.05,98.32 80.77,98.04 79.25,98.04 79.25,94.15 arc-45 78.88,93.25 78.11,92.48 U$6.1 arc-45 78.23,90.33 78.23,89.15 78.54,88.84 arc-45 C10.2
  Bottom 1.016: CH1.3 CH1.2 147.32,4.83 148.59,3.56 150.37,3.56 v151.89,5.08 | 138.18,4.06 137.67,4.57 139.95,5.59 139.95,7.87 140.72,8.64 140.72,34.78 arc45 140.34,35.68 135.13,40.89 126,40.89 arc-45 125.1,41.27 117.86,48.51 US_1.1 | US_1.1 117.86,58.42 | US_1.1 US_2.1 US_3.1 | US_3.1 US_4.1 117.86,72.64 118.87,73.66 130.05,73.66 | 92.46,142.75 92.46,144.02 93.22,144.78 105.66,144.78 | 92.46,142.75 92.46,141.73 | 105.66,144.78 168.4,144.78 168.91,144.27 168.91,135.38 168.91,121.16 168.91,116.08 | 168.91,116.08 168.91,98.55 | 168.91,98.55 168.91,73.66 | 168.91,73.66 168.91,5.84 168.4,5.33 v158.75,5.84 | 92.46,142.75 87.38,142.75 | 87.38,142.75 83.31,142.75 C6.2 | 113.54,66.04 116.59,66.04 US_3.1 | 109.98,66.04 109.47,66.55 109.47,68.58 102.87,68.58 102.36,69.09 CHALK_SW.1 QEI_1.1 66.18,73.03 arc45 66.55,73.93 v66.55,74.42 | v68.33,128.78 C5.2 | 87.38,142.75 v87.38,145.54 | v22.61,84.58 arc-45 21.73,85.19 HBRIDGE_RIGHT.11 | HBRIDGE_LEFT.11 16.92,130.4 arc-90 v18.03,130.05 | QEI_2.1 112.52,137.4 arc45 112.15,138.29 105.66,144.78 | IMU.3 158.5,133.59 arc-45 158.87,134.48 159.26,134.87 167.88,134.87 arc45 168.77,135.25 | 168.91,116.08 168.27,115.43 arc-45 167.37,115.06 154.18,115.06 R13.2 R11.2 148.47,109.74 arc-45 148.09,108.84 C4.2 146.7,106.58 arc-45 146.32,105.68 143.37,102.73 arc-45 142.48,102.36 138.68,102.36 | 168.91,73.66 168.52,73.27 arc-45 167.62,72.9 151.38,72.9 150.36,71.88 arc45 149.99,70.98 R10.2 | 168.91,98.55 168.93,101.01 arc-45 168.38,99.57 C9.2 C11.2
  Bottom 1.676: 125.48,6.6 135.64,6.6 137.67,4.57 137.92,4.32 138.68,4.32 | 138.68,4.32 144.78,4.32 CH1.3 | 138.68,4.32 139.95,5.59
  Bottom 1.778: 125.48,6.6 SVM_2.1 SVM_1.1
GNDA
  Bottom 0.305: U$5.2 69.47,9.17 C15.2 | R32.2 C17.2 | 58.42,13.21 57.91,13.21
  Bottom 0.406: OUT_5V.12 42.42,41.66 42.42,41.4
  Bottom 0.508: U$5.2 69.34,11.05 68.71,11.43 64.9,10.92 64.92,11.19 C16.2 | 38.35,42.93 OUT_5V.11 | OUT_5V.13 37.85,41.66 OUT_5V.12 | R39.2 58.42,13.21 | 59.18,13.21 59.44,13.21 65.02,11.18 | 57.91,13.21 41.66,10.41
  Bottom 0.61: C15.2 BATTERY1.1 | 58.42,13.21 58.67,13.21 | 58.67,13.21 59.18,13.21 | C17.2 66.53,20.46 arc45 65.63,20.83 U$2.14R | U$2.14L 49.56,20.61 arc-45 46.12,25.06 39.65,26.08 | 65.02,11.18 arc45 65,11.19 64.92,11.19 | C16.2 64.42,12.31 arc-45 63.52,12.68 60.96,15.24 60.96,18.02 arc-45 62.09,17.9 61.98,17.78 66.57,17.78 arc45 R32.2 | 57.91,13.21 IN_5V.11 | IN_5V.12 59.18,13.82 arc45 59.44,13.21 | IN_5V.13 59.18,12.17 arc45 58.81,13.07 58.67,13.21
  Bottom 0.813: 37.85,41.66 38.35,42.93 36.07,54.1 35.42,54.75 arc-45 35.05,55.64 35.05,56.39 35.04,56.4 arc-45 34.67,57.3 R41.2 arc-45 34.42,59.27 R40.2 | 42.42,41.4 41.39,32.5 39.65,26.08 38.35,22.35 41.66,10.41
N$1
  Bottom 0.61: R2.2 113.15,69.97 118.36,75.18 124.97,75.18 125.48,75.69 U$1.1B
  Bottom 1.016: R1.1 R2.2
N$2
  Bottom 1.016: R2.1 110.87,72.77 109.22,71.12 CHALK_SW.3
N$3
  Bottom 0.61: R7.2 U$8.3
N$4
  Bottom 0.61: U$8.4 140.72,58.17 139.45,56.9 R6.2
N$5
  Bottom 0.61: U$8.5 139.45,58.42 138.94,57.91 137.41,57.91 136.91,57.4 R5.2
N$6
  Bottom 0.61: U$8.6 138.18,59.44 137.67,58.93 136.91,58.93 135.89,57.91 134.62,57.91 134.37,57.66 R4.2
N$7
  Bottom 0.61: R4.1 134.37,52.07 133.86,51.56 129.54,51.56 128.27,52.83 128.27,70.61 127.76,71.12 US_4.3
N$8
  Bottom 0.61: R5.1 136.91,51.31 135.89,50.29 129.03,50.29 127,52.32 127,66.8 126.49,67.31 US_3.3
N$9
  Bottom 0.61: R6.1 139.45,52.07 136.4,49.02 128.78,49.02 125.73,52.07 125.73,62.99 125.22,63.5 US_2.3
N$10
  Bottom 0.61: R7.1 141.99,52.83 136.91,47.75 128.52,47.75 124.46,51.82 124.46,59.18 123.95,59.69 US_1.3
N$11
  Bottom 0.61: U$7.21 138.68,121.16 139.19,121.67 139.95,121.67 140.72,122.43 U$1.36R
N$12
  Bottom 0.61: U$8.7 136.91,63.25 135.64,63.25 | 135.64,63.25 U$8.8 | 134.37,63.25 135.64,63.25 | 134.37,63.25 U$8.9 | 134.37,63.25 133.1,63.25 U$8.10 133.1,58.17 131.83,56.9 R8.1
N$13
  Bottom 0.61: U$8.18 136.91,72.39 135.64,73.66 U$1.5B
N$14
  Bottom 0.305: U$2.12R 65.79,25.4 R38.2 C17.1 R32.1
N$15
  Bottom 0.61: U$8.19 U$1.6B
N$16
  Bottom 0.508: R3.1 U$5.3
N$17
  Bottom 0.61: QEI_2.3 107.44,136.89 arc45 107.07,137.79 106.43,138.43 102.38,138.43 arc45 101.48,138.06 100.08,136.65 U$1.20R
N$18
  Bottom 0.61: U$8.20 139.45,72.9 140.72,74.17 U$1.7B
N$19
  Bottom 0.61: U$8.21 140.72,72.39 143.26,74.93 U$1.8B
N$20
  Bottom 0.61: U$7.20 137.41,121.41 138.18,122.17 U$1.35R
N$21
  Bottom 0.356: 146.56,71.37 146.56,73.91
  Bottom 0.406: 147.57,63.5 arc45 148.01,63.68 148.59,64.26 148.59,68.56 arc45 148.22,69.46 146.56,71.37 | 146.56,73.91 147.32,74.42
  Bottom 0.61: U$8.2 143.26,62.63 arc-45 143.51,63.25 146.96,63.25 arc45 147.57,63.5 | 147.32,74.42 160.27,74.42 160.41,74.56 arc45 160.78,75.46 160.78,80.77 159.88,81.67 arc45 158.99,82.04 134.37,82.04 133.47,81.14 arc45 133.1,80.25 U$1.4B
N$22
  Bottom 0.61: R10.1 144.54,66.04 arc-45 143.65,66.41 141.99,68.07 U$8.22
N$23
  Bottom 0.61: U$7.19 136.14,121.67 135.64,122.17 U$1.34R
N$24
  Bottom 0.61: U$7.18 134.87,121.16 134.11,121.92 133.6,121.92 133.1,122.43 U$1.33R
N$25
  Bottom 1.016: CH2.3 CH2.2
N$26
  Bottom 0.406: U$7.22 139.95,117.45 arc45 140.21,116.84 144.27,116.84 146.03,116.84 arc-45 146.93,116.47 147.07,116.33 147.07,111 arc-45 146.45,110.74 141.48,110.74 141.22,110.49 U$7.2
  Bottom 0.61: R12.2 146.07,118.11 arc45 145.17,117.74 144.27,116.84
N$27  (via drill 0.61)
  Top 0.61: v121.67,18.54 120.9,19.3 120.14,19.3 119.38,18.54 119.38,9.91 120.65,8.64 124.46,8.64 128.27,4.83 147.57,4.83 148.59,3.81 169.47,3.96 170.18,4.83 170.18,102.36 168.15,104.14 v139.19,104.14
  Bottom 0.61: v121.67,18.54 SVM_1.3 | v139.19,104.14 138.68,104.65 U$7.4
N$28
  Bottom 0.406: U$10.5 83.57,138.7 arc-45 83.19,137.8 81.28,135.89 73.93,135.89 arc-45 73.03,136.26 72.9,136.4
  Bottom 0.61: 72.9,136.4 27.96,136.4 arc45 27.06,136.03 25.4,134.37 25.4,122.7 arc-45 25.03,121.8 23.62,120.4 9.16,120.4 arc45 HBRIDGE_LEFT.7
N$29  (via drill 0.61)
  Top 0.61: v125.22,18.54 125.22,19.3 124.21,20.32 119.38,20.32 118.36,19.56 118.36,9.14 119.89,7.62 123.7,7.62 127.76,3.56 147.07,3.56 147.83,2.79 170.43,3.05 171.2,3.81 171.2,103.63 168.91,105.66 v140.72,105.66
  Bottom 0.61: SVM_2.3 125.22,16.26 v125.22,18.54 | v140.72,105.66 139.95,106.43 U$7.3
N$30
  Bottom 0.406: R11.1 145.05,112.52 arc45 144.15,112.15 143.76,111.76 135.38,111.76 134.62,111
  Bottom 0.61: U$7.10 131.06,111 132.33,111 | 132.33,111 U$7.9 | 133.6,111 U$7.8 | 132.33,111 133.6,111 | 133.6,111 134.62,111 134.87,111 U$7.7
N$31
  Bottom 0.406: 77.09,139.34 arc45 77.46,138.44 77.98,138.18 79.76,138.18 U$10.2
  Bottom 0.61: 77.09,139.34 R16.2
N$32
  Bottom 0.61: U$10.16 88.65,128.02 89.92,126.75 U$1.16R
N$33
  Bottom 0.61: U$1.15R U$10.17
N$34  (via drill 0.61)
  Top 0.61: R9.2 74.15,128.78 arc-45 75.05,128.41 v75.95,127.51
  Bottom 0.406: 76.96,127.76 78.47,127.76 80.52,128.52 81.03,129.03 U$10.22
  Bottom 0.61: v75.95,127.51 76.35,127.51 arc45 76.96,127.76
N$35
  Bottom 0.406: R13.1 144.8,115.06 arc-45 143.9,115.43 143.51,115.82 140.23,115.82 arc-45 139.33,116.2 138.68,116.84 134.22,116.84 arc-45 133.6,117.09 U$7.17
  Bottom 0.61: U$7.17 133.6,116.59 132.33,116.59 | 132.33,116.59 U$7.16 | 131.06,116.59 U$7.15 | 131.06,116.59 132.33,116.59 | U$7.14 129.79,116.59 131.06,116.59
N$36
  Bottom 0.61: U$10.18 86.11,126.49 85.85,126.24 85.09,126.24 84.84,125.98 U$1.14R
N$37
  Bottom 0.61: U$10.19 84.84,127.76 83.31,126.24 82.55,126.24 82.3,125.98 U$1.13R
N$38
  Bottom 0.61: U$10.15 89.92,128.27 91.19,127 92.46,127 U$1.17R
N$39
  Bottom 0.61: U$10.14 91.19,128.52 91.69,128.02 94.49,128.02 95,127.51 U$1.18R
N$40
  Bottom 0.406: U$10.20 83.57,128.02 82.8,127.25 82.04,127.25 81.28,126.49 80.26,126.49 79.76,125.98
  Bottom 0.61: U$1.12R 79.76,125.98
N$41
  Bottom 0.406: U$10.21 82.3,128.27 81.79,128.27 81.03,127.51 80.26,127.51 78.99,126.49 77.47,126.49
  Bottom 0.61: 77.47,126.49 77.22,126.24 U$1.11R
N$42
  Bottom 0.406: U$10.4 82.3,138.7 arc-45 81.92,137.8 80.77,136.65 74.95,136.65 arc-45 74.05,137.02 73.15,137.92
  Bottom 0.61: HBRIDGE_LEFT.4 arc45 8.42,112.78 4.34,112.78 arc-45 3.44,113.15 2.79,113.79 2.79,136.63 arc-45 3.17,137.53 3.56,137.92 73.15,137.92
N$43
  Bottom 0.406: U$10.3 81.03,138.7 arc-45 80.65,137.8 80.26,137.41 75.44,137.41 73.15,139.7
  Bottom 0.61: HBRIDGE_RIGHT.4 arc45 8.42,67.56 2.03,67.56 1.52,68.07 1.52,138.94 2.54,139.7 73.15,139.7
N$44
  Bottom 0.406: U$10.7 86.11,138.7 arc-45 85.73,137.8 82.3,134.37 73.51,134.37 arc45 72.9,133.86
  Bottom 0.61: 72.9,133.86 29.99,133.86 arc45 28.84,133.49 28.19,132.84 28.19,115.33 arc-45 27.82,114.44 23.62,110.24 9.16,110.24 arc45 HBRIDGE_LEFT.3
N$45
  Bottom 0.406: U$10.6 84.84,138.7 arc-45 84.46,137.8 81.79,135.13 72.39,135.13
  Bottom 0.61: 72.39,135.13 28.97,135.13 arc45 28.08,134.76 26.67,133.35 26.67,118.89 arc-45 26.3,117.99 23.62,115.32 9.16,115.32 arc45 HBRIDGE_LEFT.5
N$46
  Bottom 0.61: U$8.17 135.64,68.83 134.37,68.83 | 134.37,68.83 U$8.16 | 133.1,68.83 U$8.15 | 133.1,68.83 134.37,68.83 | 133.1,68.83 131.83,68.83 U$8.14 131.83,72.64 132.96,73.78 arc45 R14.1
N$47
  Bottom 0.406: U$10.10 89.92,138.7 arc-45 89.54,137.8 83.82,132.08 75.44,132.08 arc-45 75.26,131.65 73.91,130.3 66.14,130.3 arc45 65.53,130.05
  Bottom 0.61: 65.53,130.05 33.8,130.05 arc45 32.9,129.68 32.51,129.29 32.51,75.71 arc45 32.11,75.54 25.4,68.83 13.99,68.83 arc45 13.09,68.46 12.7,68.07 12.7,66.31 arc-45 12.33,65.41 11.68,64.77 9.03,64.77 arc-45 HBRIDGE_RIGHT.3
N$48
  Bottom 0.406: U$10.9 88.65,138.96 arc-45 88.27,137.8 83.31,132.84 75.2,132.84 arc45 74.3,132.47 73.15,131.32
  Bottom 0.61: 73.15,131.32 31.5,131.32 30.99,130.81 30.99,76.98 arc-45 30.62,76.08 24.64,70.1 9.16,70.1 arc45 HBRIDGE_RIGHT.5
N$49
  Bottom 0.406: U$10.8 87.38,138.7 arc-45 87,137.8 82.8,133.6 74.69,133.6 arc45 73.8,133.23 73.15,132.59 72.64,132.59
  Bottom 0.61: 72.64,132.59 30.5,132.59 arc45 29.6,132.22 29.46,132.08 29.46,81.04 arc-45 29.35,80.15 27.18,75.18 9.16,75.18 arc45 HBRIDGE_RIGHT.7
N$50
  Bottom 0.61: U$1.9R 72.14,123.97 arc-45 71.76,123.07 62.74,114.05 53.61,114.05 arc45 52.71,113.67 42.16,103.12 42.16,77.74 arc-45 41.79,76.84 R17.P$2
N$51
  Bottom 0.61: U$1.8R 69.6,123.72 arc-45 69.22,122.82 62.23,115.82 53.1,115.82 arc45 52.21,115.45 40.39,103.89 40.39,79.77 arc-45 40.01,78.88 R18.P$2
N$52
  Bottom 0.61: U$1.7R 67.06,123.46 arc-45 66.68,122.56 61.21,117.09 51.58,117.09 arc45 50.94,116.72 38.86,104.9 38.86,86.12 arc-45 38.49,85.23 R19.P$2
N$53
  Bottom 0.61: U$1.6R 64.52,122.43 60.45,118.36 50.06,118.36 arc45 49.16,117.99 R20.P$2
N$54
  Bottom 0.61: U$1.5R 61.98,122.17 59.44,119.63 48.53,119.63 arc45 47.63,119.26 R21.P$2
N$55
  Bottom 0.61: U$1.4R 59.44,122.17 58.54,121.28 arc-45 57.64,120.9 43.71,120.9 arc-45 42.81,121.28 R22.2
N$56
  Bottom 1.016: R23.2 arc45 5.19,117.7 HBRIDGE_LEFT.6
N$57
  Bottom 0.61: R20.P$1 9.03,104.9 arc-45 HBRIDGE_LEFT.1
N$58
  Bottom 0.61: R21.P$1 9.16,107.7 arc45 HBRIDGE_LEFT.2
N$59
  Bottom 0.61: R22.1 9.34,127.63 arc-45 HBRIDGE_LEFT.10
  Bottom 1.016: R30.2 arc45 4.88,127.86 HBRIDGE_LEFT.10
N$60
  Bottom 0.61: R17.P$1 14.95,60.16 arc-45 14.05,59.79 HBRIDGE_RIGHT.1
N$61
  Bottom 0.61: R18.P$1 13.94,62.7 arc-45 13.04,62.33 HBRIDGE_RIGHT.2
N$62
  Bottom 0.61: R19.P$1 9.16,82.8 arc45 HBRIDGE_RIGHT.10
  Bottom 1.016: R31.2 arc45 4.12,82.65 HBRIDGE_RIGHT.10
N$63
  Bottom 1.016: R24.2 arc45 4.75,72.49 HBRIDGE_RIGHT.6
N$66
  Bottom 0.61: QEI_2.5 102.36,125.07 arc45 U$1.21R
N$67
  Bottom 0.61: QEI_2.2 109.98,125.07 arc45 U$1.24R
N$69
  Bottom 0.61: QEI_1.5 54.1,72.64 54.86,73.41 56.39,73.41 56.9,73.91 U$1.3L
N$70
  Bottom 0.61: QEI_1.3 59.18,72.64 59.44,72.9 U$1.4L
N$71
  Bottom 0.61: QEI_1.2 61.72,72.9 61.98,73.15 U$1.5L
N$72
  Bottom 0.61: IMU.2 155.96,130.83 arc45 156.33,129.93 157.48,128.78 159.75,128.78 arc-45 160.65,128.41 161.04,127.76 U$1.44R
N$73
  Bottom 0.61: IMU.1 153.42,131.08 arc45 153.79,130.18 156.46,127.51 157.99,127.51 158.5,126.75 U$1.43R
N$74
  Bottom 0.61: U$6.7 76.84,95.78 78.11,95.78 U$6.8 78.11,99.57 | 78.11,99.57 C9.1 | R25.2 76.83,101.37 arc45 77.2,100.47 78.11,99.57
N$75
  Bottom 0.406: U$1.10L 74.68,85.3 arc-45 R27.1 74.8,86.64 arc-45 75.17,87.54 75.56,87.94 U$6.3
N$76
  Bottom 0.406: U$1.9L 72.14,81.14 arc-45 72.51,82.04 R26.1 73.28,83.68 arc45 72.9,84.58 72.64,84.84 arc-90 72.39,85.09 72.39,86.39 arc-45 72.76,87.29 74.3,88.82 U$6.4
N$79  (via drill 0.61)
  Top 0.61: 134.87,104.14 v134.87,105.66
  Top 1.016: 134.87,104.14 136.4,101.09 136.65,100.84 165.86,100.84 166.88,99.82 166.88,41.66 165.73,40.5 arc-45 164.83,40.13 ACCY_NFET_2.G
  Bottom 0.61: U$7.6 136.14,107.44 arc-45 135.96,107.01 135.64,106.68 134.87,106.17 v134.87,105.66
N$80  (via drill 0.61)
  Top 0.61: 137.16,103.89 v137.16,105.66
  Top 1.016: 137.16,103.89 137.55,102.99 arc45 138.45,102.62 167.13,102.62 168.28,101.46 arc-45 168.66,100.57 168.66,33.78 155.19,33.78 154.8,34.17 arc-45 154.43,35.07 154.43,39.12 153.79,39.76 arc45 152.89,40.13 ACCY_NFET_1.G
  Bottom 0.61: U$7.5 137.41,106.95 arc-45 137.3,106.05 v137.16,105.66
N$81
  Bottom 1.676: ACCY_DRIVE.2 ACCY_DRIVE.1 146.07,49.53 arc45 145.17,49.16 143.51,47.5 U$12.P$2 143.51,43.69 | 143.51,43.69 143.51,42.94 arc45 143.88,42.05 ACCY_NFET_1.S | 143.51,43.69 U$9.P$2 156.85,42.03 arc-45 157.23,41.13 ACCY_NFET_2.S
N$82
  Top 1.676: ACCY_NFET_1.D 148.34,43.16 arc-45 148.71,44.06 U$12.P$1
  Bottom 1.676: U$12.P$1 153.65,46.23 arc45 154.55,46.6 154.94,46.99 ACCY_DRIVE.3
N$83
  Bottom 1.676: ACCY_NFET_2.D 159.77,43.08 arc-45 160.02,43.69 U$9.P$1 162.05,46.97 arc45 161.68,47.87 160.02,49.53 ACCY_DRIVE.4
N$89
  Bottom 0.508: IN_5V.22 47.75,7.37 R39.1
N$90
  Bottom 0.508: OUT_5V.22 33.53,53.09 33.53,55.88 31.24,58.17 R40.1
N$91
  Bottom 0.508: 38.61,54.36 OUT_5V.2 | 37.59,57.91 R41.1
  Bottom 0.813: 38.61,54.36 37.59,57.91
N$92
  Bottom 0.305: IN_5V.2 46.48,16.26 44.7,21.59 R42.1
NRES_1.8
  Bottom 0.508: U$3.26 17.53,10.92 17.53,6.86 35.56,3.3 54.1,3.56 IN_5V.17
NRES_5
  Bottom 0.508: IN_5V.7 52.83,17.53 57.91,33.02 U$2.9R
REGEN_1.8
  Bottom 0.305: 38.86,8.89 42.93,8.89 48.01,8.64
  Bottom 0.508: U$3.25 24.38,11.43 34.54,9.14 38.86,8.89 | 48.01,8.64 55.37,7.11 IN_5V.16
REGEN_5
  Bottom 0.508: IN_5V.8 54.1,17.53 59.18,30.73 U$2.10R
SCL  (via drill 0.61)
  Top 0.508: v77.22,30.48 v126.49,30.23
  Bottom 0.508: CH2.8 v77.22,30.48 | v126.49,30.23 CH1.8
  Bottom 0.61: CH2.8 76.71,35.56 70.36,36.07 U$2.8R
SCL_5V  (via drill 0.61)
  Top 0.61: v20.83,122.94 34.17,110.1 arc45 35.07,109.47 v60.96,109.22 60.96,103.38 39.88,79.76 v26.42,79.76
  Bottom 0.406: R29.2 75.56,114 arc45 75.44,114.3
  Bottom 0.61: U$6.6 75.56,100.44 arc45 75.19,101.34 74.93,101.6 74.93,106.79 arc-45 75.3,107.69 R29.2 | 75.44,114.3 66.57,114.3 arc45 65.67,113.93 v60.96,109.22 | v20.83,122.94 9.16,122.94 arc45 HBRIDGE_LEFT.8 | HBRIDGE_RIGHT.8 18.93,77.57 arc-45 19.83,77.2 20.57,76.45 25.65,76.45 26.04,76.84 arc45 26.42,77.74 v26.42,79.76
SDA
  Bottom 0.508: CH2.7 82.8,26.92 127.76,26.67 CH1.7
  Bottom 0.61: CH2.7 79.25,35.81 71.12,38.61 U$2.7R
SDA_5V  (via drill 0.61)
  Top 0.61: v21.59,125.22 35.19,111.62 arc45 36.09,111.25 v66.8,111.25 66.8,106.68 41.01,78.6 arc-45 40.11,78.23 v24.38,78.23
  Bottom 0.61: U$6.5 74.3,100.28 arc45 74.17,100.58 73.66,101.09 73.66,110.09 arc-45 74.03,110.99 R28.2 v66.8,111.25 | v21.59,125.22 9.03,125.22 arc-45 HBRIDGE_LEFT.9 | HBRIDGE_RIGHT.9 23.63,80.11 arc-45 v24.38,78.23
TO_PAN1_1.8
  Bottom 0.406: 37.34,1.52 56.64,1.78
  Bottom 0.508: U$3.22 16.26,15.75 15.36,14.85 arc45 14.99,13.95 14.99,5.08 16.76,2.29 37.34,1.52 | 56.64,1.78 IN_5V.15
TO_PAN1_5
  Bottom 0.305: U$2.11R 62.99,28.45
  Bottom 0.508: IN_5V.9 55.37,17.53 60.2,28.19 U$2.11R
UART4_RX_1.8  (via drill 0.61)
  Top 0.508: v14.22,36.83 15.49,47.5 18.03,50.04 21.59,50.04 24.38,47.75 33.78,10.67 37.34,2.29 v59.18,2.29
  Bottom 0.508: v14.22,36.83 U$3.8 | v59.18,2.29 57.91,3.56 IN_5V.14
UART4_RX_5
  Bottom 0.508: IN_5V.10 56.64,17.53 59.18,22.1 U$2.13R
UART4_TX_1.8
  Bottom 0.508: OUT_5V.20 27.94,50.29 15.75,45.72 15.24,39.37 U$3.6
UART4_TX_5
  Bottom 0.508: U$2.3L 43.69,51.82 OUT_5V.4
V+
  Bottom 1.676: CH2.4 89.66,7.62 92.71,10.67 103.12,10.67 114.3,21.84 125.73,21.84 129.79,17.78 129.79,16.26 127,13.46
  Bottom 1.778: SVM_1.2 SVM_2.2 127,13.46
VBATT
  Bottom 0.406: U$5.1 72.52,12.23 R38.1
  Bottom 0.61: BATTERY1.2 C15.1 71.22,6.34 71,9.29 arc90 U$5.1
  Bottom 1.016: 71.22,6.34 R3.2
VCC  (via drill 0.61)
  Top 1.016: v120.4,57.15 v115.57,57.15 | v4.83,88.14 v4.83,124.46 v4.83,134.87 4.83,146.3 5.98,147.46 arc-45 6.88,147.83 v94.74,147.83 104.53,138.04 arc-45 104.9,137.14 v104.9,135.89 | v170.43,109.73 170.3,109.59 arc-45 169.4,109.22 v144.53,109.22 142.87,110.88 arc45 141.97,111.25 v81.28,111.25
  Bottom 0.406: 78.49,142.75 78.49,141.99 | 78.49,147.83 78.49,142.75 | 78.49,142.75 C6.1 | v144.53,109.22 142.75,107.44
  Bottom 0.61: 78.49,141.99 U$10.1 | R31.1 3.11,85.47 arc45 2.79,85.34 2.79,77.75 arc45 3.17,76.85 R24.1 | U$7.1 142.49,108.05 arc45 142.75,107.44 C4.1 | C2.1 144.64,60.68 arc45 U$8.1
  Bottom 1.016: 142.24,11.18 CH1.4 | US_4.2 US_3.2 US_2.2 US_1.2 v120.4,57.15 120.4,48.26 125.61,43.04 arc45 126.51,42.67 135.64,42.67 | 142.24,11.18 144.27,9.14 151.13,9.14 156.72,3.56 169.93,3.81 170.43,4.32 v170.43,109.73 170.43,146.05 170.18,147.83 v94.74,147.83 78.49,147.83 | v115.57,57.15 115.06,57.66 115.06,63.75 114.18,64.64 R1.2 111.64,64.52 108.71,64.52 107.95,65.02 107.95,67.06 102.11,67.06 99.82,69.6 67.06,69.6 63.75,66.29 59.94,66.29 59.3,66.69 57.15,68.07 56.64,68.58 QEI_1.4 | 142.24,11.18 142.24,35.54 arc45 141.87,36.44 135.64,42.67 | v4.83,134.87 R30.1 | v4.83,124.46 R23.1 | v4.83,88.14 R31.1 | v104.9,135.89 QEI_2.4 | 135.64,42.67 arc-45 136,43.54 144.53,52.07 144.53,57.89 arc-45 C2.1 | v81.28,111.25 R28.1 arc-90 78.36,109.98 R29.1 arc-90 79.63,106.68 R25.1 arc90 79.62,104.63 C11.1
VCCINT  (via drill 0.61)
  Top 0.508: v54.36,30.99 v62.74,16
  Bottom 0.305: IN_5V.1 43.18,15.75 R42.2
  Bottom 0.508: U$5.5 69.6,14.1 C16.1 v62.74,16 | OUT_5V.1 43.69,55.63 45.97,55.37 46.99,55.12 U$2.1L 56.39,51.31 | 54.1,31.24 v54.36,30.99 | R42.2 40.89,18.8 40.89,23.75 44.45,23.75 46.99,18.8 52.05,18.69 53.09,23.62 54.1,31.24 | 54.1,31.24 54.1,32.77 56.39,46.99 56.39,51.31 | 56.39,51.31 U$2.1R
VDD  (3 unrouted)
  Bottom 0.61: U$8.23 143.26,68.83 144.53,68.83 U$8.24 144.53,72.64 arc-45 145.14,72.9 C1.1 arc45 145.29,73.23 145.29,74.68 | 51.82,125.97 arc-45 51.93,126.25 | 65.53,127.25 72.63,127.25 arc45 73.52,127.63 73.66,127.76 73.66,128.44 arc-45 C5.1 74.74,128.78 arc45 75.64,129.15 76.53,130.05 U$10.24 U$10.23 | U$7.23 141.22,120.65 142.49,120.65 | 142.49,120.65 U$7.24 | U$1.45R 163.58,122.95 arc-45 163.2,122.06 162.81,121.67 144.04,121.67 arc45 143.14,121.29 142.62,120.78 | 142.62,120.78 142.49,120.65 | C3.1 144.12,120.41 arc45 143.23,120.78 142.62,120.78 | 70.87,92.71 76.84,92.71 U$6.2 arc45 76.82,90.61 C10.1 76.82,88.29 arc45 77.2,87.4 77.47,87.12 77.47,85.91 arc45 R27.2 arc-45 77.72,85.3 77.72,82.8 R26.2
  Bottom 1.016: U$1.1R 51.82,125.97 | 51.93,126.25 52.94,127.25 65.53,127.25 | IMU.4 161.04,130.83 arc45 161.41,129.93 163.58,127.76 U$1.45R | U$1.14B 158.5,77.49 arc-45 158.12,76.59 157.23,75.69 147.08,75.69 arc45 146.19,75.32 145.29,74.68 | U$1.1L 51.82,79.99 arc-45 52.19,80.89 53.34,82.04 61.7,82.04 arc45 64.13,85.97 70.87,92.71
VPP  (via drill 0.61)
  Top 0.61: v38.35,5.33 v34.04,33.53
  Top 1.016: v34.04,33.53 24.89,51.56 14.06,55.34 v14.12,55.63
  Bottom 0.305: IN_5V.24 IN_5V.23
  Bottom 0.406: OUT_5V.24 OUT_5V.23
  Bottom 0.61: v38.35,5.33 IN_5V.24
  Bottom 1.016: U$3.1 25.91,41.66 v34.04,33.53 | v14.12,55.63 OUT_5V.24

### Text on the board
tDocu: Common point ground is sourced from PSU